# Altium schematic sheet [03]-Heating Element.SchDoc: ENTER SHEET TITLE
size B; Engineer: ENTER ENGINEER NAME; Organization: CUAir; Address1: L3, 12a Rodborough Rd; Address2: Frenchs Forest; Address3: NSW; Address4: Australia 2086; Revision: ENTER REVISION NUMBER; CompetitionYear: 2019; CPN: ENTER CPN; PROJECT: ENTER PROJECT NAME
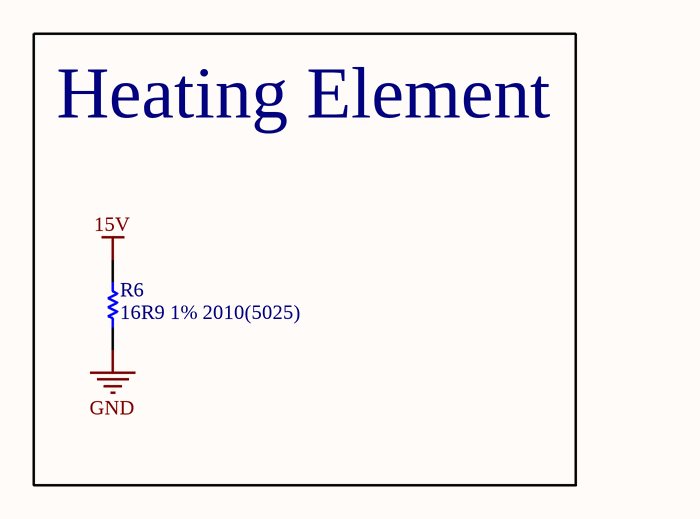
[diagram p0: [03]-Heating Element.SchDoc]

## Parts
R6  16R9 1% 2010(5025)  [RESC2010(5025)_N]

## Blocks framed on the sheet
Heating Element: R6

## Nets
15V: R6.2
GND: R6.1

## Notes on the sheet
- Project
- Title
- Size:
- Date:
- B
- Number:
- Revision:
- File:

## Library data of the parts
R6 = CMP-1017-00308-1: 16R9 0.75W 1% 2010 (5025 Metric)  SMD; Value: 16.90 Ohm; Case-EIA: 2010; Case-Metric: 5025; Tolerance: 1 %; Power: 0.75 W; Technology: SMT